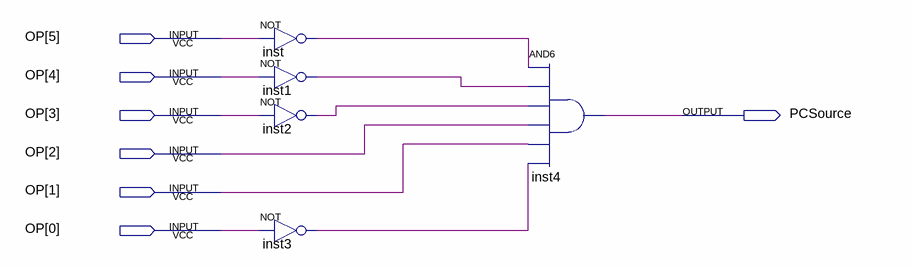
[diagram p0: schematic sheet]
// Quartus schematic PCSource.bdf as structural Verilog: 5 symbols, 7 pins
module PCSource (
  input  [5:0] OP,
  output PCSource
);

  wire inst1_out, inst2_out, inst3_out, inst_out;

  not inst (inst_out, OP[5]);
  not inst1 (inst1_out, OP[4]);
  not inst2 (inst2_out, OP[3]);
  not inst3 (inst3_out, OP[0]);
  and inst4 (PCSource, inst_out, inst1_out, inst2_out, OP[2], OP[1], inst3_out);
endmodule
